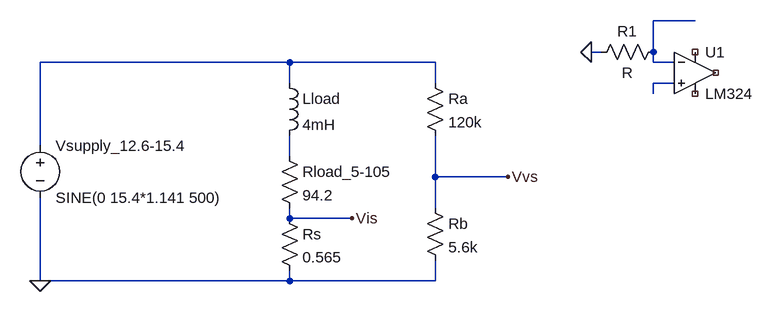
[diagram p0: schematic LTspice Simulation.asc]
LTspice Simulation.asc, the LTspice schematic file:
Version 4.1
SHEET 1 880 680
WIRE 688 -240 624 -240
WIRE 544 -192 528 -192
WIRE 624 -192 624 -240
WIRE 64 -176 -320 -176
WIRE 288 -176 64 -176
WIRE 624 -176 624 -192
WIRE 656 -176 624 -176
WIRE 64 -144 64 -176
WIRE 288 -144 288 -176
WIRE 656 -144 624 -144
WIRE 624 -128 624 -144
WIRE -320 -48 -320 -176
WIRE 64 -32 64 -64
WIRE 288 0 288 -64
WIRE 400 0 288 0
WIRE 288 48 288 0
WIRE 64 64 64 48
WIRE 160 64 64 64
WIRE -320 160 -320 32
WIRE 64 160 64 144
WIRE 64 160 -320 160
WIRE 288 160 288 128
WIRE 288 160 64 160
FLAG 160 64 Vis
FLAG 400 0 Vvs
FLAG -320 160 0
FLAG 528 -192 0
SYMBOL voltage -320 -64 R0
WINDOW 123 0 0 Left 0
WINDOW 39 0 0 Left 0
SYMATTR InstName Vsupply_12.6-15.4
SYMATTR Value SINE(0 15.4*1.141 500)
SYMBOL ind 48 -160 R0
SYMATTR InstName Lload
SYMATTR Value 4mH
SYMATTR SpiceLine Rser=1m
SYMBOL res 48 -48 R0
SYMATTR InstName Rload_5-105
SYMATTR Value 94.2
SYMBOL res 272 -160 R0
SYMATTR InstName Ra
SYMATTR Value 120k
SYMBOL res 272 32 R0
SYMATTR InstName Rb
SYMATTR Value 5.6k
SYMBOL res 48 48 R0
SYMATTR InstName Rs
SYMATTR Value 0.565
SYMBOL OpAmps\\opamp2 688 -224 R0
SYMATTR InstName U1
SYMATTR Value LM324
SYMBOL res 640 -208 R90
WINDOW 0 0 56 VBottom 2
WINDOW 3 32 56 VTop 2
SYMATTR InstName R1

The netlist it stands for:
* LTspice Simulation.asc
Vsupply_12.6-15.4 N002 0 SINE(0 15.4*1.141 500)
Lload N002 N004 4mH Rser=1m
Rload_5-105 N004 Vis 94.2
Ra N002 Vvs 120k
Rb Vvs 0 5.6k
Rs Vis 0 0.565
X§U1 N003 N001 NC_01 NC_02 NC_03 LM324  ; pins In+ In- V+ V- OUT
R1 N001 0 R
.backanno
.end